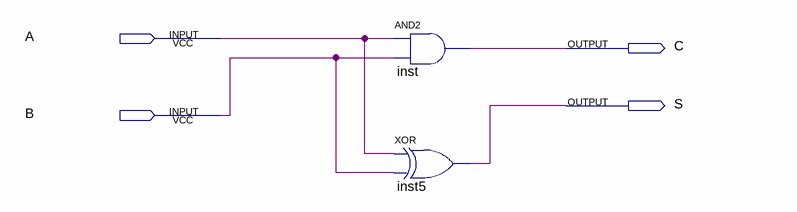
[diagram p0: schematic sheet]
// Quartus schematic halfAdder.bdf as structural Verilog: 2 symbols, 4 pins
module halfAdder (
  input  A,
  input  B,
  output C,
  output S
);

  and inst (C, A, B);
  xor inst5 (S, A, B);
endmodule
